# EAGLE design MeeBooster_midi (EAGLE 7.5.0)
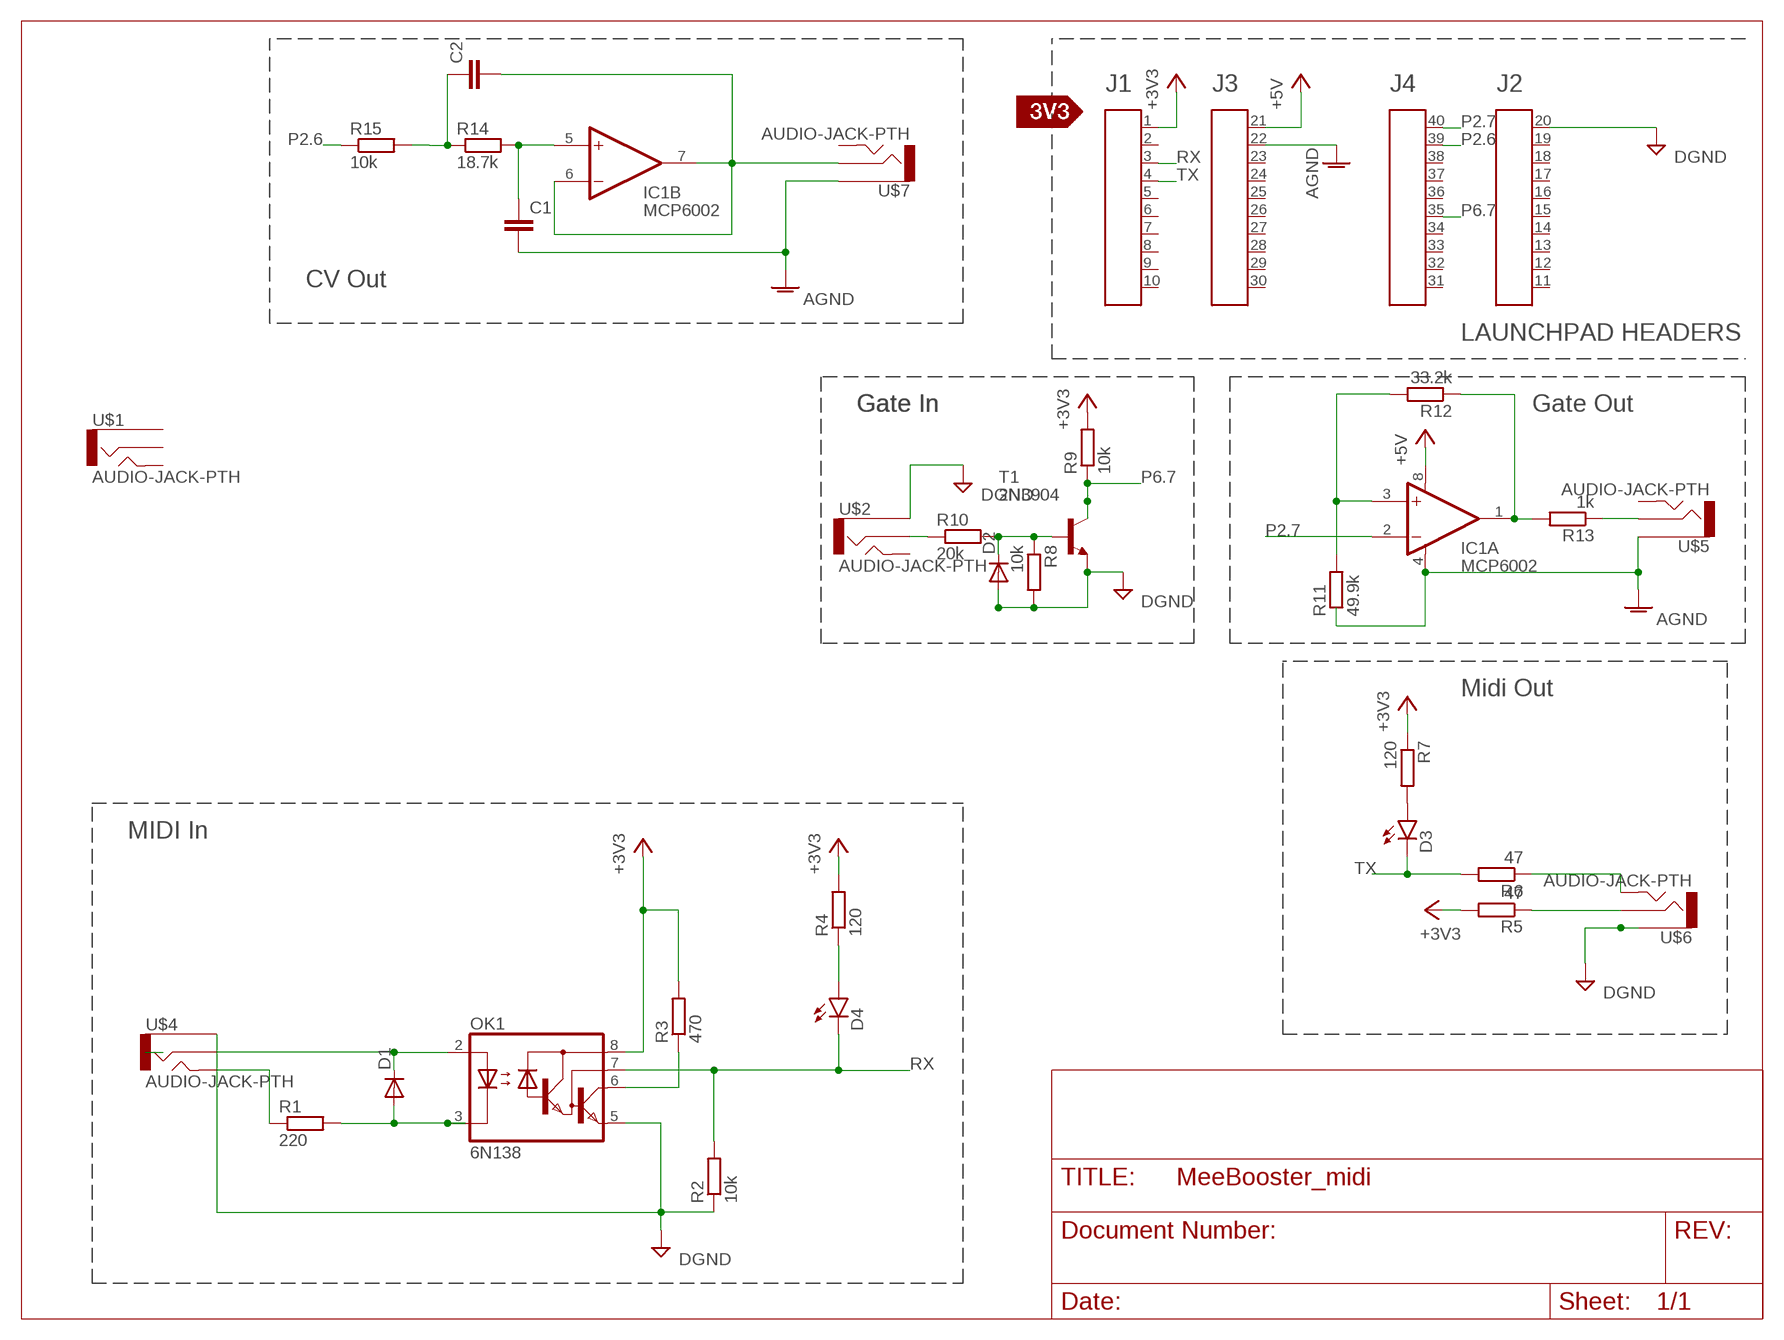
[diagram p0: schematic, sheet 1]

## Parts
A1  HEADER4X10-BOOSTERPACK  [4X10-BOOSTERPACK]
C1  CAP0603-CAP  [0603-CAP]
C2  CAP0603-CAP  [0603-CAP]
D1  DIODE1N4148  [DIODE-1N4148]
D2  DIODE1N4148  [DIODE-1N4148]
D3  LED5MM  [LED5MM]
D4  LED5MM  [LED5MM]
IC1  MCP6002  [DIL08]
OK1  6N138  [DIL08]
R1  220  R-EU_M1206  [M1206]
R2  10k  R-EU_M1206  [M1206]
R3  470  R-EU_M1206  [M1206]
R4  120  R-EU_M1206  [M1206]
R5  47  R-EU_M1206  [M1206]
R6  47  R-EU_M1206  [M1206]
R7  120  R-EU_M1206  [M1206]
R8  10k  R-EU_M1206  [M1206]
R9  10k  R-EU_M1206  [M1206]
R10  20k  R-EU_M1206  [M1206]
R11  49.9k  R-EU_M1206  [M1206]
R12  33.2k  R-EU_M1206  [M1206]
R13  1k  R-EU_M1206  [M1206]
R14  18.7k  R-EU_M1206  [M1206]
R15  10k  R-EU_M1206  [M1206]
T1  2N3904  [TO92]
U$1  AUDIO-JACK-PTH  [AUDIO-JACK]
U$2  AUDIO-JACK-PTH  [AUDIO-JACK]
U$3  SILK_3V3_TAG  [SILK_3V3_TAG]
U$4  AUDIO-JACK-PTH  [AUDIO-JACK]
U$5  AUDIO-JACK-PTH  [AUDIO-JACK]
U$6  AUDIO-JACK-PTH  [AUDIO-JACK]
U$7  AUDIO-JACK-PTH  [AUDIO-JACK]

## Nets
5V: A1.1
+3V3: OK1.8(VCC) R3.2 R4.2 R5.2 R7.1 R9.2
+5V: A1.21 IC1.8(A:V+)
AGND: A1.22 C1.2 IC1.4(A:V-) R11.1 U$5.1 U$7.1
DGND: A1.20 D2.A OK1.5(GND) R2.1 R8.2 T1.3(E) U$2.1 U$4.1 U$6.1
N$1: D1.C OK1.2(A) U$4.2
N$2: D1.A OK1.3(C) R1.2
N$3: D2.C R8.1 R10.2 T1.2(B)
N$4: OK1.6(VO) R3.1
N$5: R1.1 U$4.5
N$7: R5.1 U$6.2
N$8: R6.1 U$6.5
N$9: D3.A R7.2
N$11: D4.A R4.1
N$12: R10.1 U$2.2
N$13: IC1.1(A:OUT) R12.1 R13.2
N$14: IC1.3(A:+IN) R11.2 R12.2
N$15: C2.2 IC1.6(B:-IN) IC1.7(B:OUT)
N$16: R13.1 U$5.2
N$17: C1.1 IC1.5(B:+IN) R14.2
N$19: C2.1 R14.1 R15.2
P2.6: A1.39 R15.1
P2.7: A1.40 IC1.2(A:-IN)
P6.7: A1.35 R9.1 T1.1(C)
RX: A1.3 D4.K(C) OK1.7(VB) R2.2
TX: A1.4 D3.K(C) R6.2
Unconnected: A1.2 A1.5 A1.6 A1.7 A1.8 A1.9 A1.10 A1.11 A1.12 A1.13 A1.14 A1.15 A1.16 A1.17 A1.18 A1.19 A1.23 A1.24 A1.25 A1.26 A1.27 A1.28 A1.29 A1.30 A1.31 A1.32 A1.33 A1.34 A1.36 A1.37 A1.38 U$1.1 U$1.2 U$1.5 U$2.5 U$5.5 U$7.2 U$7.5

## Notes on the sheet
- CV Out
- LAUNCHPAD HEADERS
- Gate In | Gate In | Gate Out
- Midi Out
- MIDI In

## Library data of the parts
A1 = Public_BP_Library:HEADER4X10-BOOSTERPACK
C1 C2 = SparkFun-Capacitors:CAP: Capacitor Standard 0603 ceramic capacitor, and 0.1" leaded capacitor.
D1 D2 = meeblip:DIODE: Diodes 1N4148 and 1N4001 power diodes.
D3 D4 = SparkFun-LED:LED: LEDs Standard schematic elements and footprints for 5mm, 3mm, 1206, and 0603 sized LEDs. 5mm - Spark Fun Electronics SKU : COM-00529 (and others)
IC1 = meeblip:MCP6002: Dual Op Amp
OK1 = optocoupler:6N138: MOTOROLA OPTO COUPLER; MF: VISHAY/TELEFUNKEN; MPN: 6N138; OC_FARNELL: 9860150; OC_NEWARK: 35K5294
R1-R15 = rcl:R-EU_: RESISTOR, European symbol
T1 = transistor:2N3904: NPN TRANSISTOR
U$1 U$2 U$4-U$7 = meeblip:AUDIO-JACK: 3.5mm Audio Jack 3.5mm PCB mount audio jack. Sparkfun SKU: PRT-08032 (from SparkFun library)
U$3 = Public_BP_Library:SILK_3V3_TAG

## Board
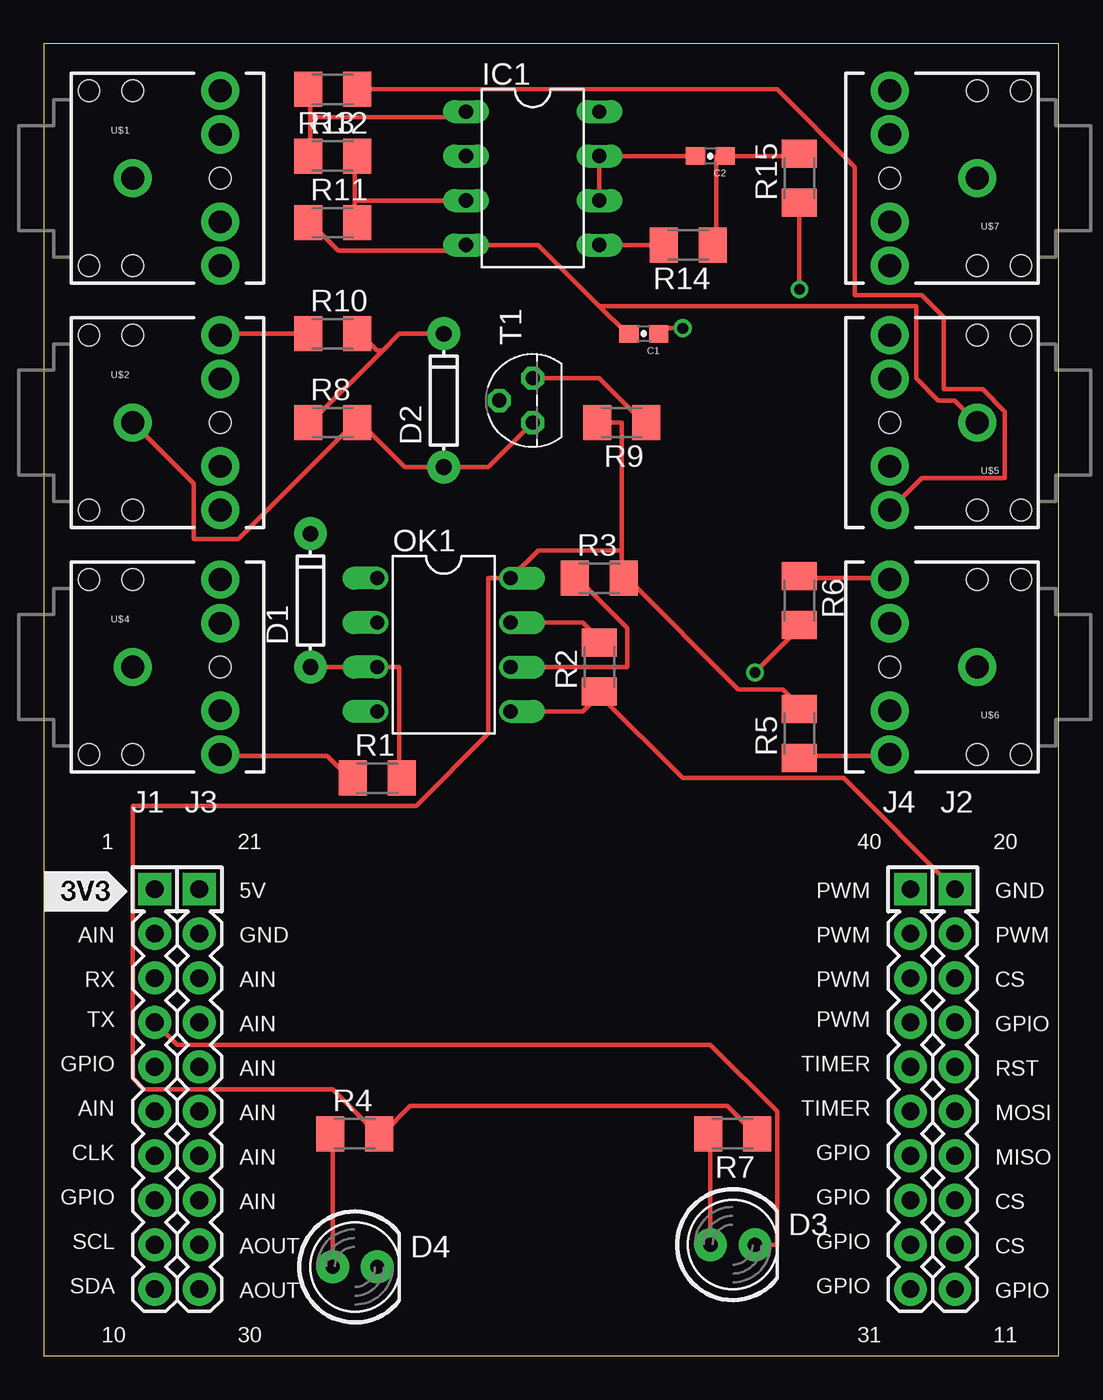
[diagram p1: board, top side]
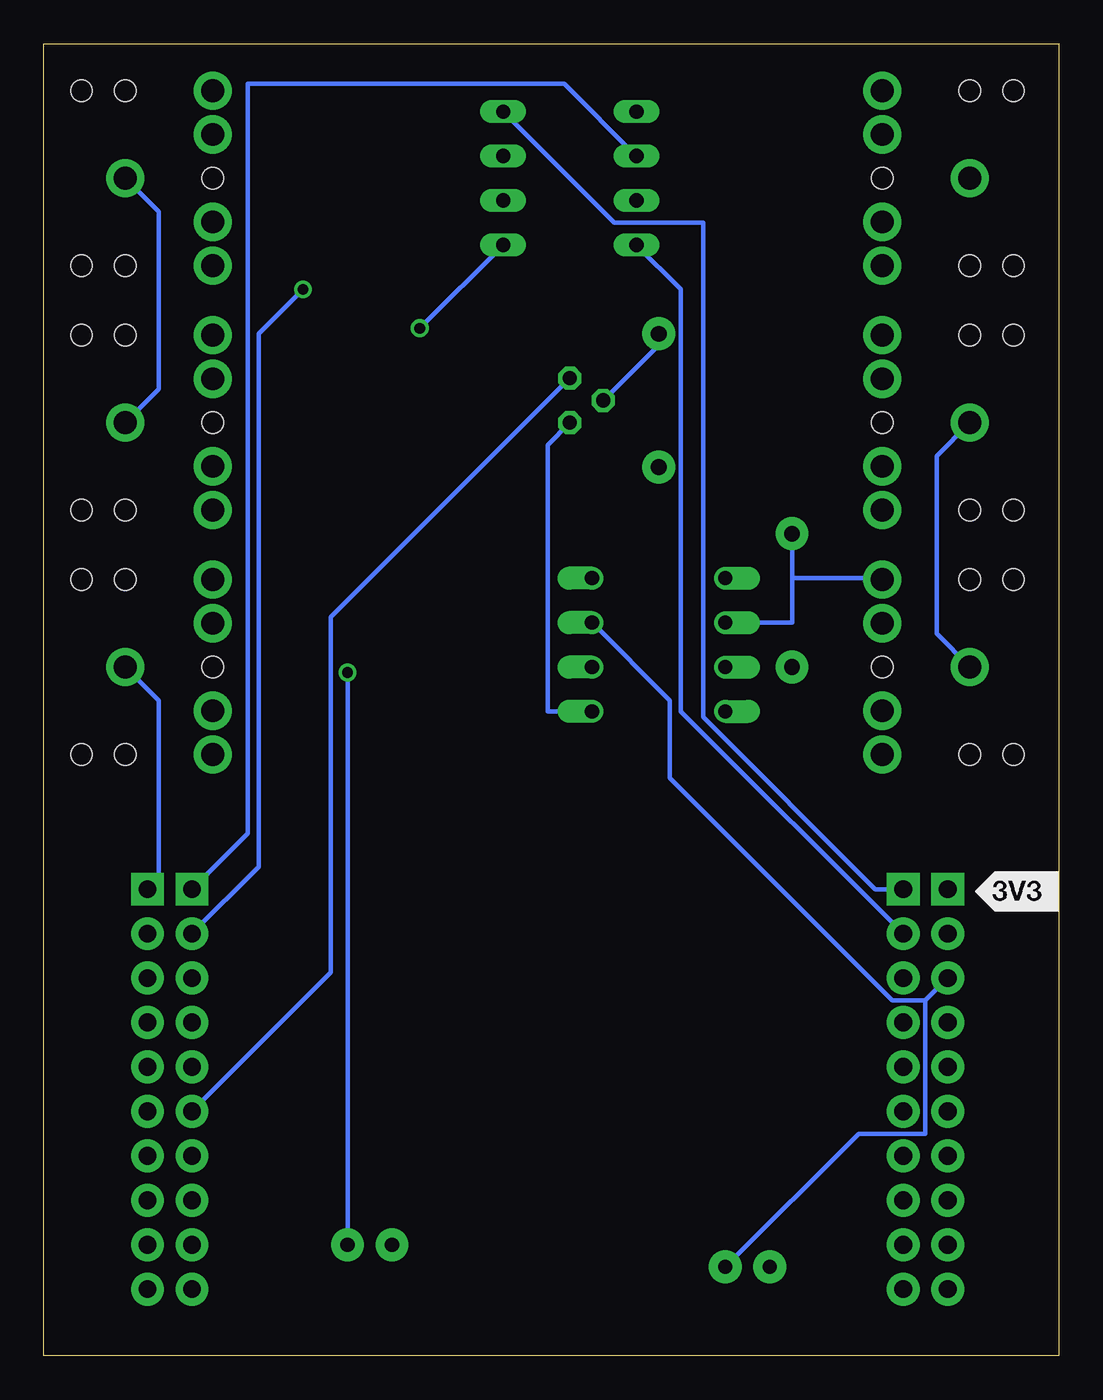
[diagram p2: board, bottom side, seen from below]

Size 58 x 75 mm. Coordinates in mm from the lower left corner, seen from the top.
Outline: 0,0 58,0 58,75 0,75 0,0
Copper layers (1*16): Top 0.035mm / dielectric 1.5mm / Bottom 0.035mm
Design rules "default": minimum track width 10mil, minimum drill 24mil, track to track 8mil, track to pad 8mil, pad to pad 8mil, via to via 8mil, smd to smd 8mil, copper to edge 40mil, drill to drill 8mil, minimum pad ring 10mil, minimum via ring 8mil, stop-mask expansion 4mil, vias tented up to drill 0mil, thermal gap 10mil

### Footprints (pad centres in the part's own frame; a part is rotated, then mirrored left to right if it is on the bottom)
4X10-BOOSTERPACK = drill 1.016 pad 1.88 square: 1 0,10.16; 20 45.72,10.16; 21 2.54,10.16; 40 43.18,10.16 | drill 1.016 pad 1.88: 2 0,7.62; 3 0,5.08; 4 0,2.54; 5 0,0; 6 0,-2.54; 7 0,-5.08; 8 0,-7.62; 9 0,-10.16; 10 0,-12.7; 11 45.72,-12.7; 12 45.72,-10.16; 13 45.72,-7.62; 14 45.72,-5.08; 15 45.72,-2.54; 16 45.72,0; 17 45.72,2.54; 18 45.72,5.08; 19 45.72,7.62; 22 2.54,7.62; 23 2.54,5.08; 24 2.54,2.54; 25 2.54,0; 26 2.54,-2.54; 27 2.54,-5.08; 28 2.54,-7.62; 29 2.54,-10.16; 30 2.54,-12.7; 31 43.18,-12.7; 32 43.18,-10.16; 33 43.18,-7.62; 34 43.18,-5.08; 35 43.18,-2.54; 36 43.18,0; 37 43.18,2.54; 38 43.18,5.08; 39 43.18,7.62
0603-CAP = smd 1.1 x 1: 1 -0.85,0; 2 0.85,0
DIODE-1N4148 = drill 0.9 pad 1.88: A -3.81,0; C 3.81,0
LED5MM = drill 0.813 pad 1.88: A -1.27,0; K 1.27,0
DIL08 = drill 0.813 long: 1 -3.81,-3.81; 2 -1.27,-3.81; 3 1.27,-3.81; 4 3.81,-3.81; 5 3.81,3.81; 6 1.27,3.81; 7 -1.27,3.81; 8 -3.81,3.81
DIL08' = drill 0.813 offset: 1 -3.81,-3.81; 2 -1.27,-3.81; 3 1.27,-3.81; 4 3.81,-3.81; 5 3.81,3.81; 6 1.27,3.81; 7 -1.27,3.81; 8 -3.81,3.81
M1206 = smd 1.6 x 2: 1 -1.4,0; 2 1.4,0
TO92 = drill 0.813 octagon: 1 1.27,0; 2 0,1.905; 3 -1.27,0
AUDIO-JACK = drill 1.3 pad 2.184: 1 0,0; 2 5,5; 3 5,2.5; 4 5,-2.5; 5 5,-5 | hole 1.2: 0,5; -2.5,5; -2.5,-5; 0,-5; 5,0

### Placement (x,y rotation side)
A1  6.35,16.51 0 top
C1  34.29,58.42 180 top
C2  38.1,68.58 180 top
D1  15.24,43.18 90 top
D2  22.86,54.61 90 top
D3  39.37,6.35 0 top
D4  17.78,5.08 0 top
IC1  27.94,67.31 270 top
OK1  6N138  [DIL08']  22.86,40.64 270 top
R1  19.05,33.02 0 top
R2  31.75,39.37 90 top
R3  31.75,44.45 0 top
R4  17.78,12.7 0 top
R5  43.18,35.56 90 top
R6  43.18,43.18 270 top
R7  39.37,12.7 180 top
R8  16.51,53.34 0 top
R9  33.02,53.34 180 top
R10  16.51,58.42 0 top
R11  16.51,64.77 0 top
R12  16.51,68.58 0 top
R13  16.51,72.39 180 top
R14  36.83,63.5 180 top
R15  43.18,67.31 90 top
T1  27.94,54.61 90 top
U$1  5.08,67.31 0 top
U$2  5.08,53.34 0 top
U$3  0,25.4 0 top
U$4  5.08,39.37 0 top
U$5  53.34,53.34 180 top
U$6  53.34,39.37 180 top
U$7  53.34,67.31 180 top

### Tracks (layer width: path | path; a pad name or v marks a point on that pad's centre or on a via)
+3V3
  Top 0.254: R7.1 40.64,12.7 39.05,14.29 20.95,14.29 19.37,12.7 R4.2 19.05,12.7 16.51,15.24 5.71,15.24 5.08,15.88 5.08,31.43 21.27,31.43 25.4,35.56 25.4,44.45 OK1.8 28.26,46.04 33.02,46.04 | 33.02,46.04 33.02,53.34 R9.2 | 33.02,46.04 33.02,44.45 R3.2 33.34,44.45 39.69,38.1 42.23,38.1 43.18,37.15 R5.2
+5V
  Bottom 0.254: IC1.8 25.4,64.77 20.32,64.77 20.32,36.51 10.48,26.67 A1.21
AGND
  Top 0.254: 31.75,60.01 28.26,63.5 IC1.4 23.81,63.18 16.83,63.18 15.24,64.77 R11.1 | 31.75,60.01 33.34,58.42 C1.2 | U$5.1 52.07,54.61 51.12,54.61 49.85,55.88 49.85,60.01 31.75,60.01
  Bottom 0.254: U$5.1 51.44,55.24 51.44,65.41 U$7.1 | A1.22 21.59,36.83 21.59,60.96 IC1.4
DGND
  Top 0.254: 31.75,37.78 30.8,36.83 OK1.5 | T1.3 25.4,50.8 D2.A 20.64,50.8 18.1,53.34 R8.2 17.78,53.34 11.11,46.67 8.57,46.67 8.57,49.85 U$2.1 | A1.20 45.72,33.02 36.51,33.02 31.75,37.78 | 31.75,37.78 R2.1
  Bottom 0.254: U$4.1 6.99,41.27 6.99,51.44 U$2.1 | A1.20 51.44,27.3 51.44,37.47 U$6.1 | OK1.5 29.21,36.83 29.21,52.07 T1.3
N$1
  Bottom 0.254: OK1.2 15.24,41.91 15.24,44.45 | D1.C 15.24,44.45 | 15.24,44.45 10.16,44.45 U$4.2
N$2
  Top 0.254: R1.2 20.32,33.02 20.32,39.37 OK1.3 D1.A
N$3
  Top 0.254: 19.37,57.47 20.32,58.42 D2.C | 19.37,57.47 15.24,53.34 R8.1 | 19.37,57.47 19.05,57.47 18.1,58.42 R10.2
  Bottom 0.254: T1.2 22.86,57.78 D2.C
N$4
  Top 0.254: OK1.6 33.34,39.37 33.34,41.59 30.48,44.45 R3.1
N$5
  Top 0.254: R1.1 17.46,33.02 16.19,34.29 10.16,34.29 U$4.5
N$7
  Top 0.254: R5.1 43.18,34.29 48.26,34.29 U$6.2
N$8
  Top 0.254: R6.1 43.18,44.45 48.26,44.45 U$6.5
N$9
  Top 0.254: D3.A 38.1,12.7 R7.2
N$11
  Top 0.254: D4.A 16.51,12.7 R4.1
N$12
  Top 0.254: R10.1 10.16,58.42 U$2.2
N$13
  Top 0.254: 15.24,70.8 15.24,72.39 R13.2 | 15.24,70.8 15.24,68.58 R12.1 | IC1.1 23.81,70.8 15.24,70.8
N$14
  Top 0.254: 17.78,66.04 17.78,68.58 R12.2 | 17.78,66.04 17.78,64.77 R11.2 | 17.78,66.04 IC1.3
N$15
  Top 0.254: C2.2 IC1.7 IC1.6
N$16
  Top 0.254: R13.1 41.91,72.39 46.35,67.94 46.35,60.64 50.16,60.64 51.44,59.37 51.44,55.24 53.66,55.24 54.93,53.98 54.93,50.16 50.16,50.16 U$5.2
N$17  (via drill 0.61)
  Top 0.254: v36.51,58.74 35.56,58.74 35.24,58.42 C1.1 | IC1.5 R14.2
  Bottom 0.254: IC1.5 v36.51,58.74
N$19
  Top 0.254: R15.2 43.18,68.58 C2.1 38.42,68.58 38.42,63.5 R14.1
P2.6  (via drill 0.61)
  Top 0.254: v43.18,60.96 R15.1
  Bottom 0.254: v43.18,60.96 45.72,58.42 45.72,27.94 A1.39
P2.7
  Bottom 0.254: IC1.2 28.26,72.71 46.35,72.71 46.35,29.84 A1.40
P6.7
  Top 0.254: T1.1 31.75,55.88 34.29,53.34 R9.1
  Bottom 0.254: A1.35 41.59,21.91 41.59,42.23 T1.1
RX
  Top 0.254: OK1.7 30.8,41.91 31.75,40.96 R2.2
  Bottom 0.254: D4.K 11.43,12.7 7.62,12.7 7.62,20.32 | A1.3 7.62,20.32 | OK1.7 22.23,37.47 22.23,33.02 9.53,20.32 7.62,20.32
TX  (via drill 0.61)
  Top 0.254: v40.64,39.05 43.18,41.59 R6.2 | A1.4 7.62,17.78 38.1,17.78 41.91,13.97 41.91,6.35 D3.K
  Bottom 0.254: D3.K v40.64,39.05